# Altium project 200108 Discharge Module R0.PrjPcb
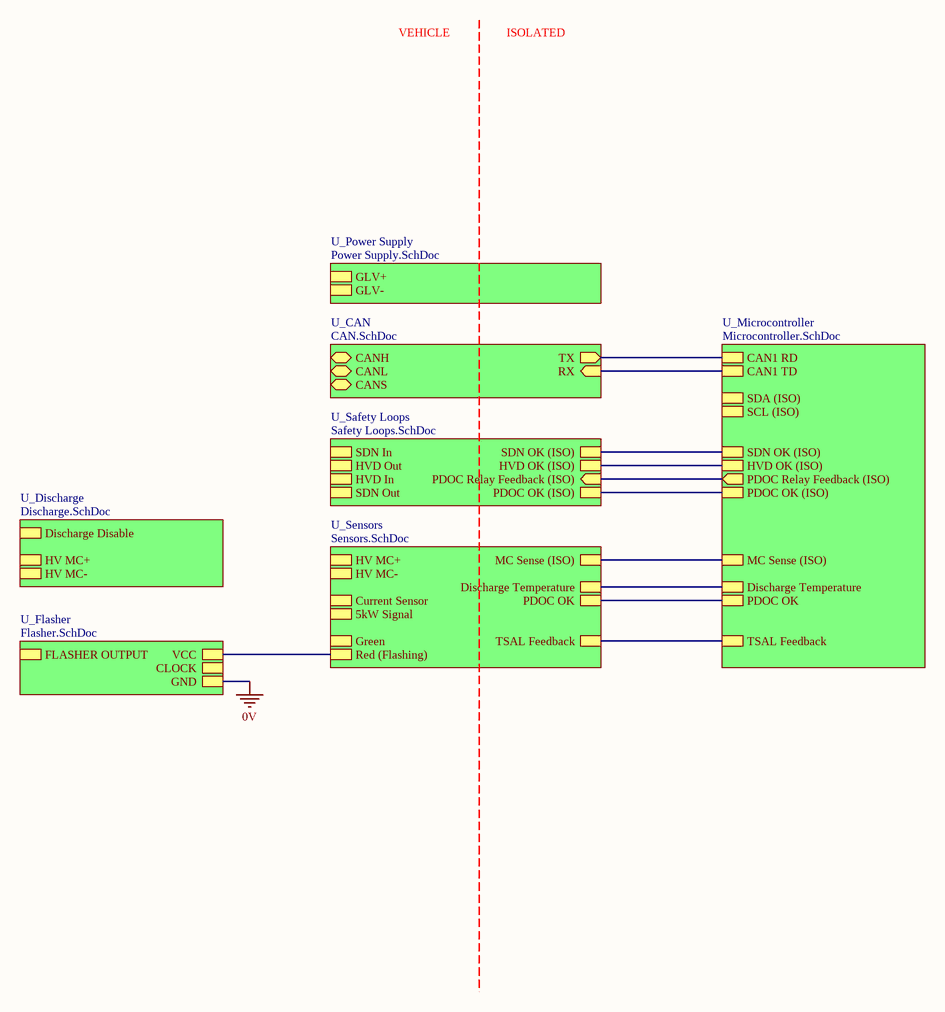
[diagram p0: Top Level.SchDoc]
7 sheets, 169 parts. Net scope: hierarchical (ports join the sheet entries above them; power ports are global).
Sheets:
  Top Level.SchDoc
    U_Power Supply = Power Supply.SchDoc
    U_Safety Loops = Safety Loops.SchDoc
    U_Sensors = Sensors.SchDoc
    U_Flasher = Flasher.SchDoc
    U_Microcontroller = Microcontroller.SchDoc
    U_Discharge = Discharge.SchDoc

## Sheet Top Level.SchDoc
size A4

### Sub-sheets
U_CAN = CAN.SchDoc (file not in this document): CANS (bidir), RX (in), CANL (bidir), CANH (bidir), TX (out)
U_Discharge = Discharge.SchDoc: HV MC+, HV MC-, Discharge Disable
U_Flasher = Flasher.SchDoc: VCC, GND, CLOCK, FLASHER OUTPUT
U_Microcontroller = Microcontroller.SchDoc: CAN1 RD, CAN1 TD, SDN OK (ISO), HVD OK (ISO), PDOC Relay Feedback (ISO) (out), PDOC OK (ISO), MC Sense (ISO), Discharge Temperature, PDOC OK, TSAL Feedback, SDA (ISO), SCL (ISO)
U_Power Supply = Power Supply.SchDoc: GLV+, GLV-
U_Safety Loops = Safety Loops.SchDoc: HVD Out, SDN In, SDN OK (ISO), SDN Out, HVD In, HVD OK (ISO), PDOC Relay Feedback (ISO) (in), PDOC OK (ISO)
U_Sensors = Sensors.SchDoc: HV MC+, HV MC-, MC Sense (ISO), TSAL Feedback, Current Sensor, 5kW Signal, Green, Red (Flashing), PDOC OK, Discharge Temperature

### Nets
VCC: sheet U_Sensors/Red (Flashing), sheet U_Flasher/VCC
PB8: sheet U_CAN/TX, sheet U_Microcontroller/CAN1 RD
PB9: sheet U_CAN/RX, sheet U_Microcontroller/CAN1 TD
NetC29#1_2: sheet U_Sensors/Discharge Temperature, sheet U_Microcontroller/Discharge Temperature
NetC38_2: sheet U_Sensors/MC Sense (ISO), sheet U_Microcontroller/MC Sense (ISO)
NetHVD_Bypass1_1: sheet U_Safety Loops/HVD Out, sheet U_Safety Loops/SDN In, sheet U_Safety Loops/HVD In
NetK1_4: sheet U_Safety Loops/PDOC Relay Feedback (ISO), sheet U_Microcontroller/PDOC Relay Feedback (ISO)
NetK2_13: sheet U_Sensors/TSAL Feedback, sheet U_Microcontroller/TSAL Feedback
NetQ2_G: sheet U_Safety Loops/PDOC OK (ISO), sheet U_Microcontroller/PDOC OK (ISO)
NetR15_2: sheet U_Safety Loops/SDN OK (ISO), sheet U_Microcontroller/SDN OK (ISO)
NetR18_2: sheet U_Safety Loops/HVD OK (ISO), sheet U_Microcontroller/HVD OK (ISO)
NetR46_1: sheet U_Sensors/PDOC OK, sheet U_Microcontroller/PDOC OK

### Notes on the sheet
- VEHICLE
- ISOLATED

## Sheet Power Supply.SchDoc
size A4
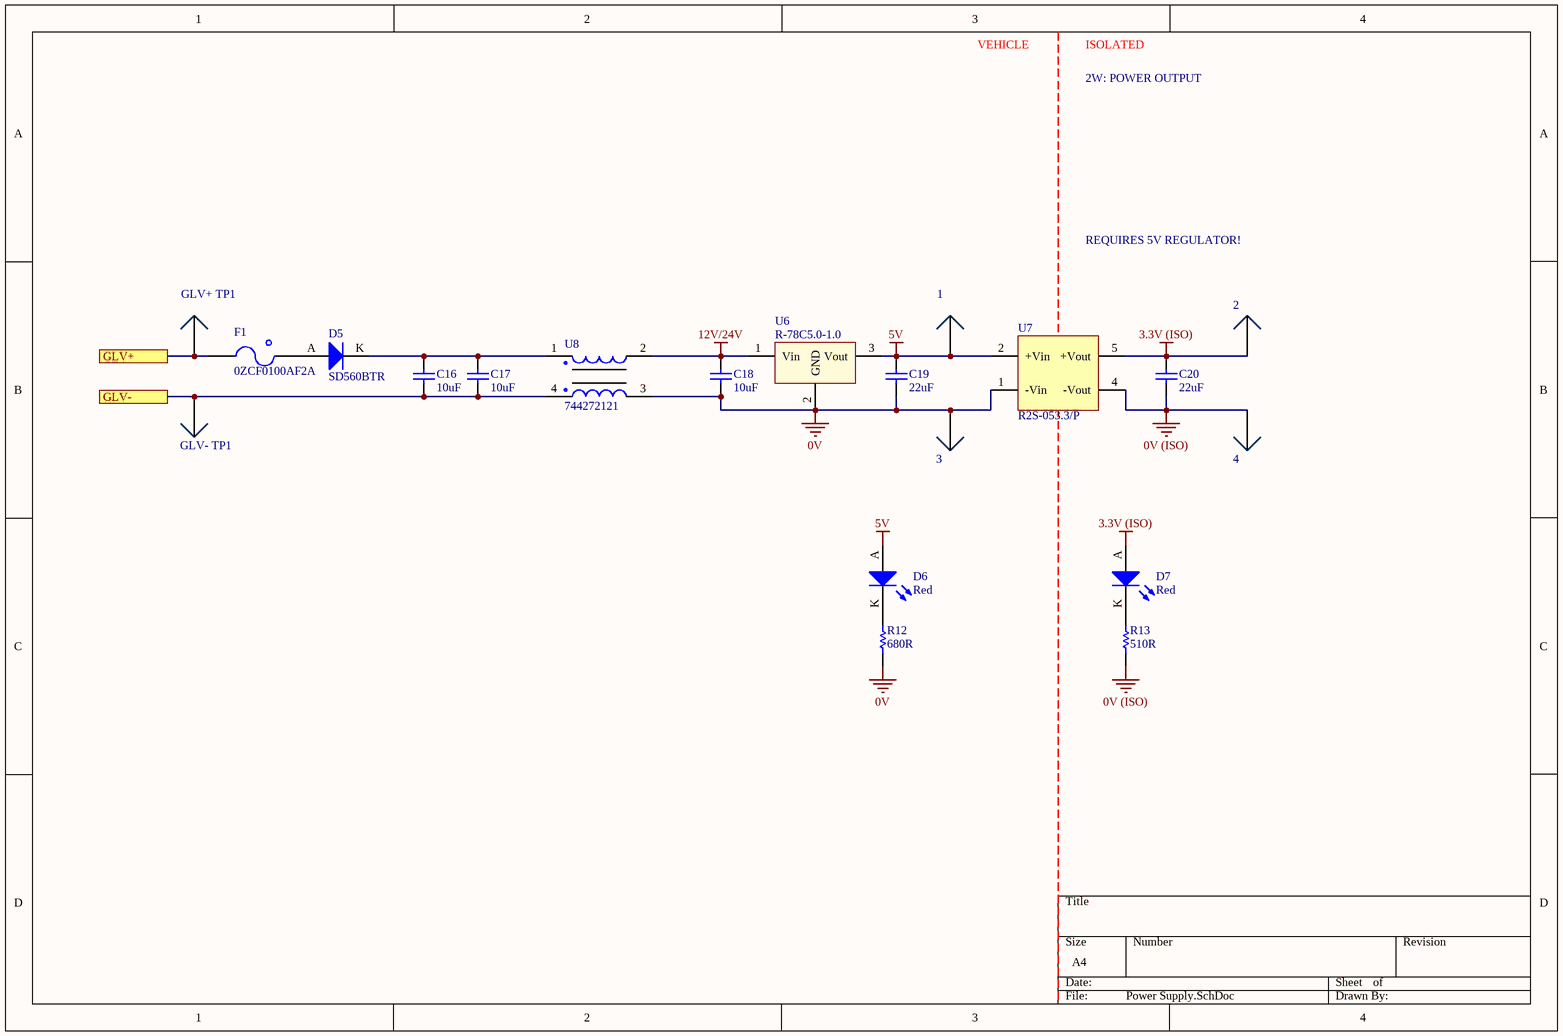
[diagram p1: Power Supply.SchDoc]

### Parts
1  0mm  [SMD Test Point]  (value not drawn)
2  0mm  [SMD Test Point]  (value not drawn)
3  0mm  [SMD Test Point]  (value not drawn)
4  0mm  [SMD Test Point]  (value not drawn)
C16  10uF  [0805]
C17  10uF  [0805]
C18  10uF  [0805]
C19  22uF  [1206]
C20  22uF  [1206]
D5  SD560BTR  [SMB Diode]
D6  Red  [0805 LED]
D7  Red  [0805 LED]
F1  0ZCF0100AF2A  [2920]
GLV+_TP1  0mm  [SMD Test Point]  (value not drawn)
GLV-_TP1  0mm  [SMD Test Point]  (value not drawn)
R12  680R  [0805]
R13  510R  [0805]
U6  R-78C5.0-1.0  [RECOM 3-SIP]
U7  R2S-053.3/P  [RECOM 8-SMD (5 Pin)]
U8  744272121  [Wurth 4-PC Pad]

### Ports
GLV+, GLV-

### Nets
0V: 3.1 C18.1 C19.1 R12.1 U6.2(GND) U7.1(-Vin) U8.3
0V (ISO): 4.1 C20.1 R13.1 U7.4(-Vout)
3.3V (ISO): 2.1 C20.2 D7.A U7.5(+Vout)
5V: 1.1 C19.2 D6.A U6.3(Vout) U7.2(+Vin)
12V/24V: C18.2 U6.1(Vin) U8.2
NetC16_1: C16.1 C17.1 GLV-_TP1.1 U8.4 ; port GLV-
NetC16_2: C16.2 C17.2 D5.K U8.1
NetD5_A: D5.A F1.2
NetD6_K: D6.K R12.2
NetD7_K: D7.K R13.2
NetF1_1: F1.1 GLV+_TP1.1 ; port GLV+

### Notes on the sheet
- VEHICLE
- ISOLATED
- 2W: POWER OUTPUT
- REQUIRES 5V REGULATOR!

### Library data of the parts
1-4 GLV+_TP1 GLV-_TP1 = SMD Test Point: Positions: 1; Row Spacing: 0; Flange: No; Contact: NA; Part Number: SMD Test Point; Pitch: 0mm; Angle: 0
C16-C18 = GRM21BR6YA106KE43L: Manufacturer: muRata; Tolerance: 10%; Material: X5R; Rated Voltage: 50V; Part Number: GRM21BR6YA106KE43L; Value: 10uF; Digikey Part Number: 490-10514-6-ND
C19 C20 = CC1206MKX5R7BB226: Manufacturer: YAGEO; Tolerance: 20%; Material: Ceramic; Rated Voltage: 16V; Part Number: CC1206MKX5R7BB226; Value: 22uF; Digikey Part Number: 311-1997-2-ND
D5 = SD560BTR: 1.2V_F 600V 5A SMB; Manufacturer: SMC Diode Solutions; Part Number: SD560BTR; Digikey Part Number: 1655-1530-2-ND; Digikey Link: https://www.digikey.com/product-detail/en/smc-diode-solutions/SD560BTR/1655-1530-2-ND/6022620
D6 D7 = SML-210LTT86: Red LED Indication - Discrete 1.75V 0805 (2012 Metric); Manufacturer: ROHM Semiconductor; Part Number: SML-210LTT86; Colour: Red; Digikey Part Number: 511-1286-1-ND; Digikey Link: https://www.digikey.com/product-detail/en/rohm-semiconductor/SML-210LTT86/511-1286-1-ND/637099
F1 = 0ZCF0100AF2A: PTC RESET FUSE 60V 1A 292; Manufacturer: Littelfuse Inc.; Part Number: 0ZCF0100AF2A; Digikey Part Number: 507-2070-1-ND; Digikey Link: https://www.digikey.com/product-detail/en/bel-fuse-inc/0ZCF0100AF2A/507-2070-1-ND/6210547
R12 = RC0805FR07680RL: Manufacturer: YAGEO; Tolerance: 0.01; Rated Voltage: 0.125W; Part Number: RC0805FR07680RL; Value: 680R; Material: FR-07
R13 = RC0805FR07510RL: Manufacturer: YAGEO; Tolerance: 0.01; Rated Voltage: 0.125W; Part Number: RC0805FR07510RL; Value: 510R; Material: FR-07
U6 = R-78C5.0-1.0: CONV DC/DC 1A 5V OUT SIP VERT; Manufacturer: Recom; Isolation: Non-Isolated; Part Number: R-78C5.0-1.0; Digikey Part Number: 945-1395-5-ND; Digikey Link: https://www.digikey.com.au/product-detail/en/recom-power/R-78C5.0-1.0/945-1395-5-ND/2652148
U7 = R2S-053.3/P: Isolated Module DC DC Converter 1 Output 3.3V 606mA 4.5V - 5.5V Input; Manufacturer: Recom; Output Power: 2W; Efficiency: 0.75; Part Number: R2S-053.3/P; Input Voltage: 4.5V-5.5V; Output Voltage: 3.3V; Isolation: Isolated; Digikey Part Number: 945-2677-5-ND; Digikey Link: https://www.digikey.com/product-detail/en/recom-power/R2S-053.3-P/945-2677-5-ND/2302804
U8 = 744272121: 120µH @ 100kHz 2 Line Common Mode Choke Surface Mount 460 Ohms @ 30MHz 2.5A DCR 25mOhm; Manufacturer: Wurth Electronics Inc; Inductance: 120uH @ 100kHz; Part Number: 744272121; Impedence: 460 Ohms @ 30MHz; Material: Wirewound; Rated Current: 2.5A; Digikey Part Number: 732-1489-1-ND; Digikey Link: https://www.digikey.com/product-detail/en/w-rth-elektronik/744272121/732-1489-1-ND/1639501

## Sheet Safety Loops.SchDoc
size A4
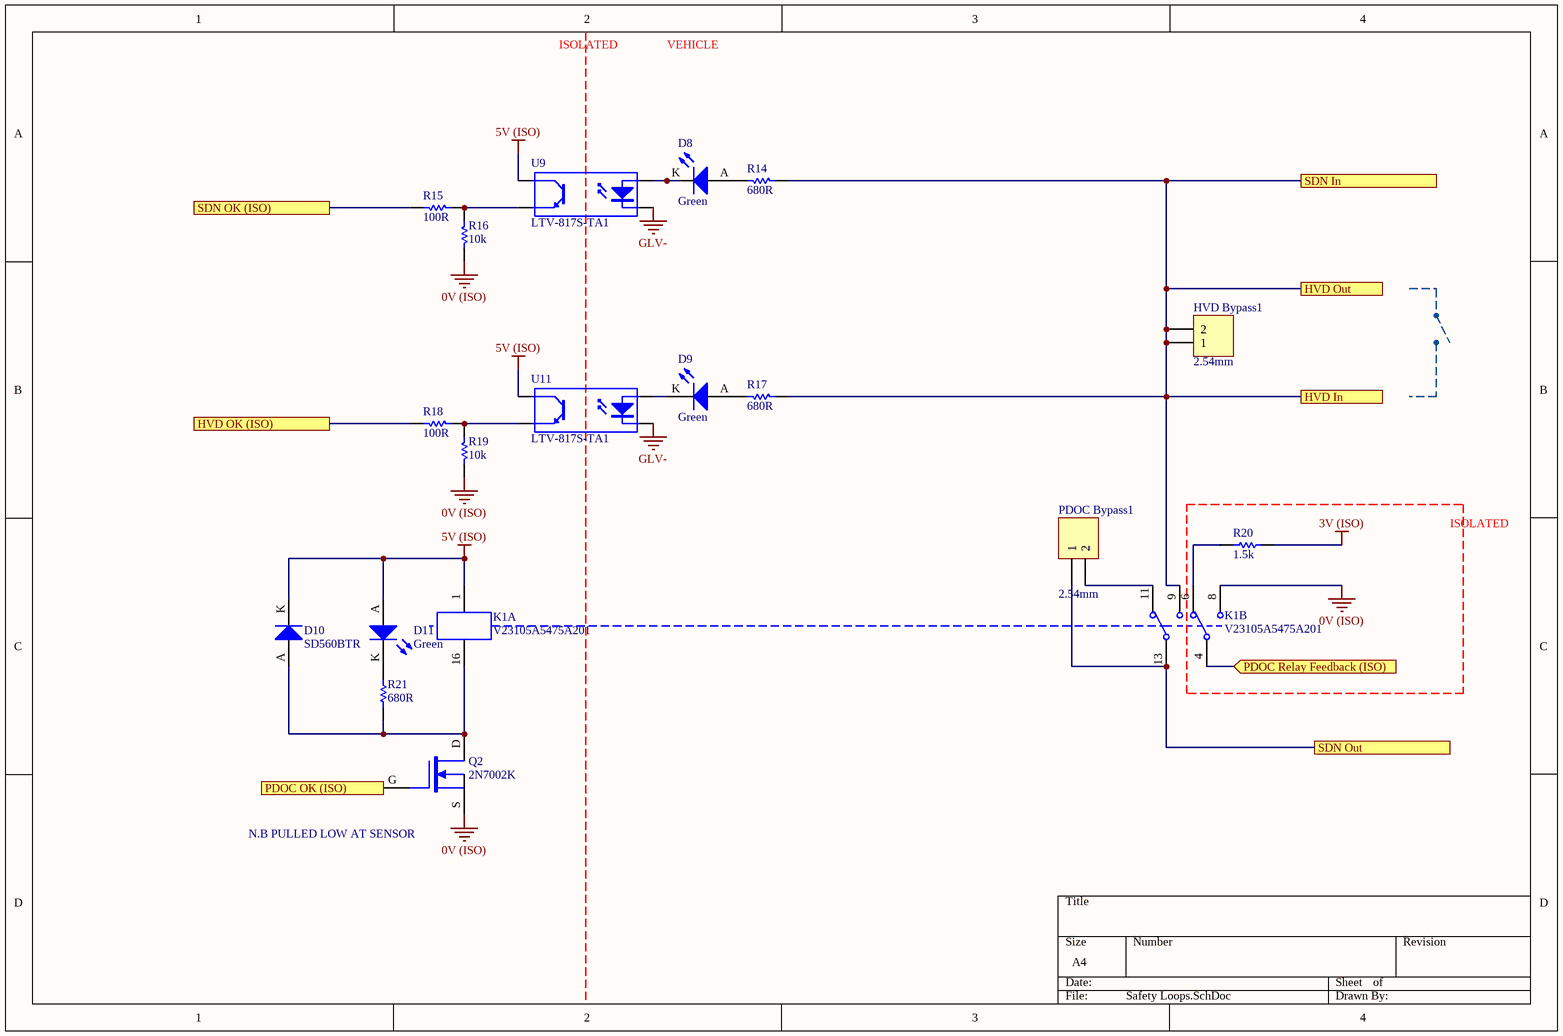
[diagram p2: Safety Loops.SchDoc]

### Parts
D8  Green  [0805 LED]
D9  Green  [0805 LED]
D10  SD560BTR  [SMB Diode]
D11  Green  [0805 LED]
HVD_Bypass1  2.54mm  [TH 2.54mm Header 1x2]
K1  V23105A5475A201  [TI 2-DIL]  (parts A,B of 2)
PDOC_Bypass1  2.54mm  [TH 2.54mm Header 1x2]
Q2  2N7002K  [SOT-343_N]
R14  680R  [0805]
R15  100R  [0805]
R16  10k  [0805]
R17  680R  [0805]
R18  100R  [0805]
R19  10k  [0805]
R20  1.5k  [0805]
R21  680R  [0805]
U9  LTV-817S-TA1  [ON 4-SMD]
U11  LTV-817S-TA1  [ON 4-SMD]

### Blocks framed on the sheet
ISOLATED: K1 R20

### Ports
HVD In, HVD OK (ISO), HVD Out, PDOC OK (ISO), PDOC Relay Feedback (ISO) (in), SDN In, SDN OK (ISO), SDN Out

### Nets
0V (ISO): K1.8 Q2.S R16.1 R19.1
3V (ISO): R20.2
5V (ISO): D10.K D11.A K1.1 U9.4(C) U11.4(C)
GLV-: U9.2(K) U11.2(K)
NetD8_A: D8.A R14.1
NetD8_K: D8.K U9.1(A)
NetD9_A: D9.A R17.1
NetD9_K: D9.K U11.1(A)
NetD10_A: D10.A K1.16 Q2.D R21.1
NetD11_K: D11.K R21.2
NetHVD_Bypass1_1: HVD_Bypass1.1 HVD_Bypass1.2 K1.9 R14.2 R17.2 ; port HVD Out, port HVD In, port SDN In
NetK1_4: K1.4 ; port PDOC Relay Feedback (ISO)
NetK1_6: K1.6 R20.1
NetK1_11: K1.11 PDOC_Bypass1.2
NetK1_13: K1.13 PDOC_Bypass1.1 ; port SDN Out
NetQ2_G: Q2.G ; port PDOC OK (ISO)
NetR15_1: R15.1 R16.2 U9.3(E)
NetR15_2: R15.2 ; port SDN OK (ISO)
NetR18_1: R18.1 R19.2 U11.3(E)
NetR18_2: R18.2 ; port HVD OK (ISO)

### Notes on the sheet
- ISOLATED
- VEHICLE
- (near Q2) N.B PULLED LOW AT SENSOR

### Library data of the parts
D8 D9 D11 = SML-210FTT86: Green LED Indication - Discrete 1.75V 0805 (2012 Metric); Manufacturer: ROHM Semiconductor; Part Number: SML-210FTT86; Colour: Green; Digikey Part Number: 511-1285-1-ND; Digikey Link: https://www.digikey.com/product-detail/en/rohm-semiconductor/SML-210FTT86/511-1285-1-ND/637098
D10 = SD560BTR: as D5 on sheet Power Supply; Part Number: SD560BTR; Digikey Part Number: 1655-1530-2-ND; Digikey Link: https://www.digikey.com/product-detail/en/smc-diode-solutions/SD560BTR/1655-1530-2-ND/6022620
HVD_Bypass1 PDOC_Bypass1 = TH 2.54mm Header 1x2: Positions: 2; Angle: 0; Flange: No; Contact: NA; Part Number: TH 2.54mm Header 1x2; Pitch: 2.54mm; Row Spacing: 2.54mm
K1 = V23105A5475A201: 5V DPDT Relay 3A 220VDC; Manufacturer: Axicom; Part Number: V23105A5475A201; Digikey Part Number: PB383-ND; Digikey Link: https://www.digikey.com/products/en?mpart=V23105A5001A201&v=41
Q2 = 2N7002K: 60V 380mA, NFET MOSTFET (Small Signal); Manufacturer: ON Semiconductor; Published: 24-Mar-1999; LatestRevisionDate: 29-May-2009; LatestRevisionNote: IPC-7351 Footprint Added.; PackageVersion: Sep-2000; PackageReference: SOT-343; Publisher: Altium Limited; PackageDescription: 4-Pin SOT-343 Package 1.3 mm Pitch, 2.1 mm Lead Span; Part Number: 2N7002K; Digikey Part Number: 2N7002KCT-ND; Digikey Link: https://www.digikey.com/product-detail/en/on-semiconductor/2N7002K/2N7002KCT-ND/2060375; Qty: 30
R14 R17 R21 = RC0805FR07680RL: as R12 on sheet Power Supply; Part Number: RC0805FR07680RL; Value: 680R; Material: FR-07
R15 R18 = RC0805FR07100RL: Manufacturer: YAGEO; Tolerance: 0.01; Rated Voltage: 0.125W; Part Number: RC0805FR07100RL; Value: 100R; Material: FR-07
R16 R19 = RC0805FR0710KL: Manufacturer: YAGEO; Tolerance: 0.01; Rated Voltage: 0.125W; Part Number: RC0805FR0710KL; Value: 10k; Material: FR-07
R20 = RC0805FR071K5L: Manufacturer: YAGEO; Tolerance: 0.01; Rated Voltage: 0.125W; Part Number: RC0805FR071K5L; Value: 1.5k; Material: FR-07
U9 U11 = LTV-817S-TA1: 35V 50ma Optocoupler (VF=1.2V); Manufacturer: Lite-On Inc; Part Number: LTV-817S-TA1; Digikey Part Number: 160-1893-2-ND; Digikey Link: https://www.digikey.com/product-detail/en/lite-on-inc/LTV-817S-TA1/160-1893-2-ND/388451

## Sheet Sensors.SchDoc
size A3
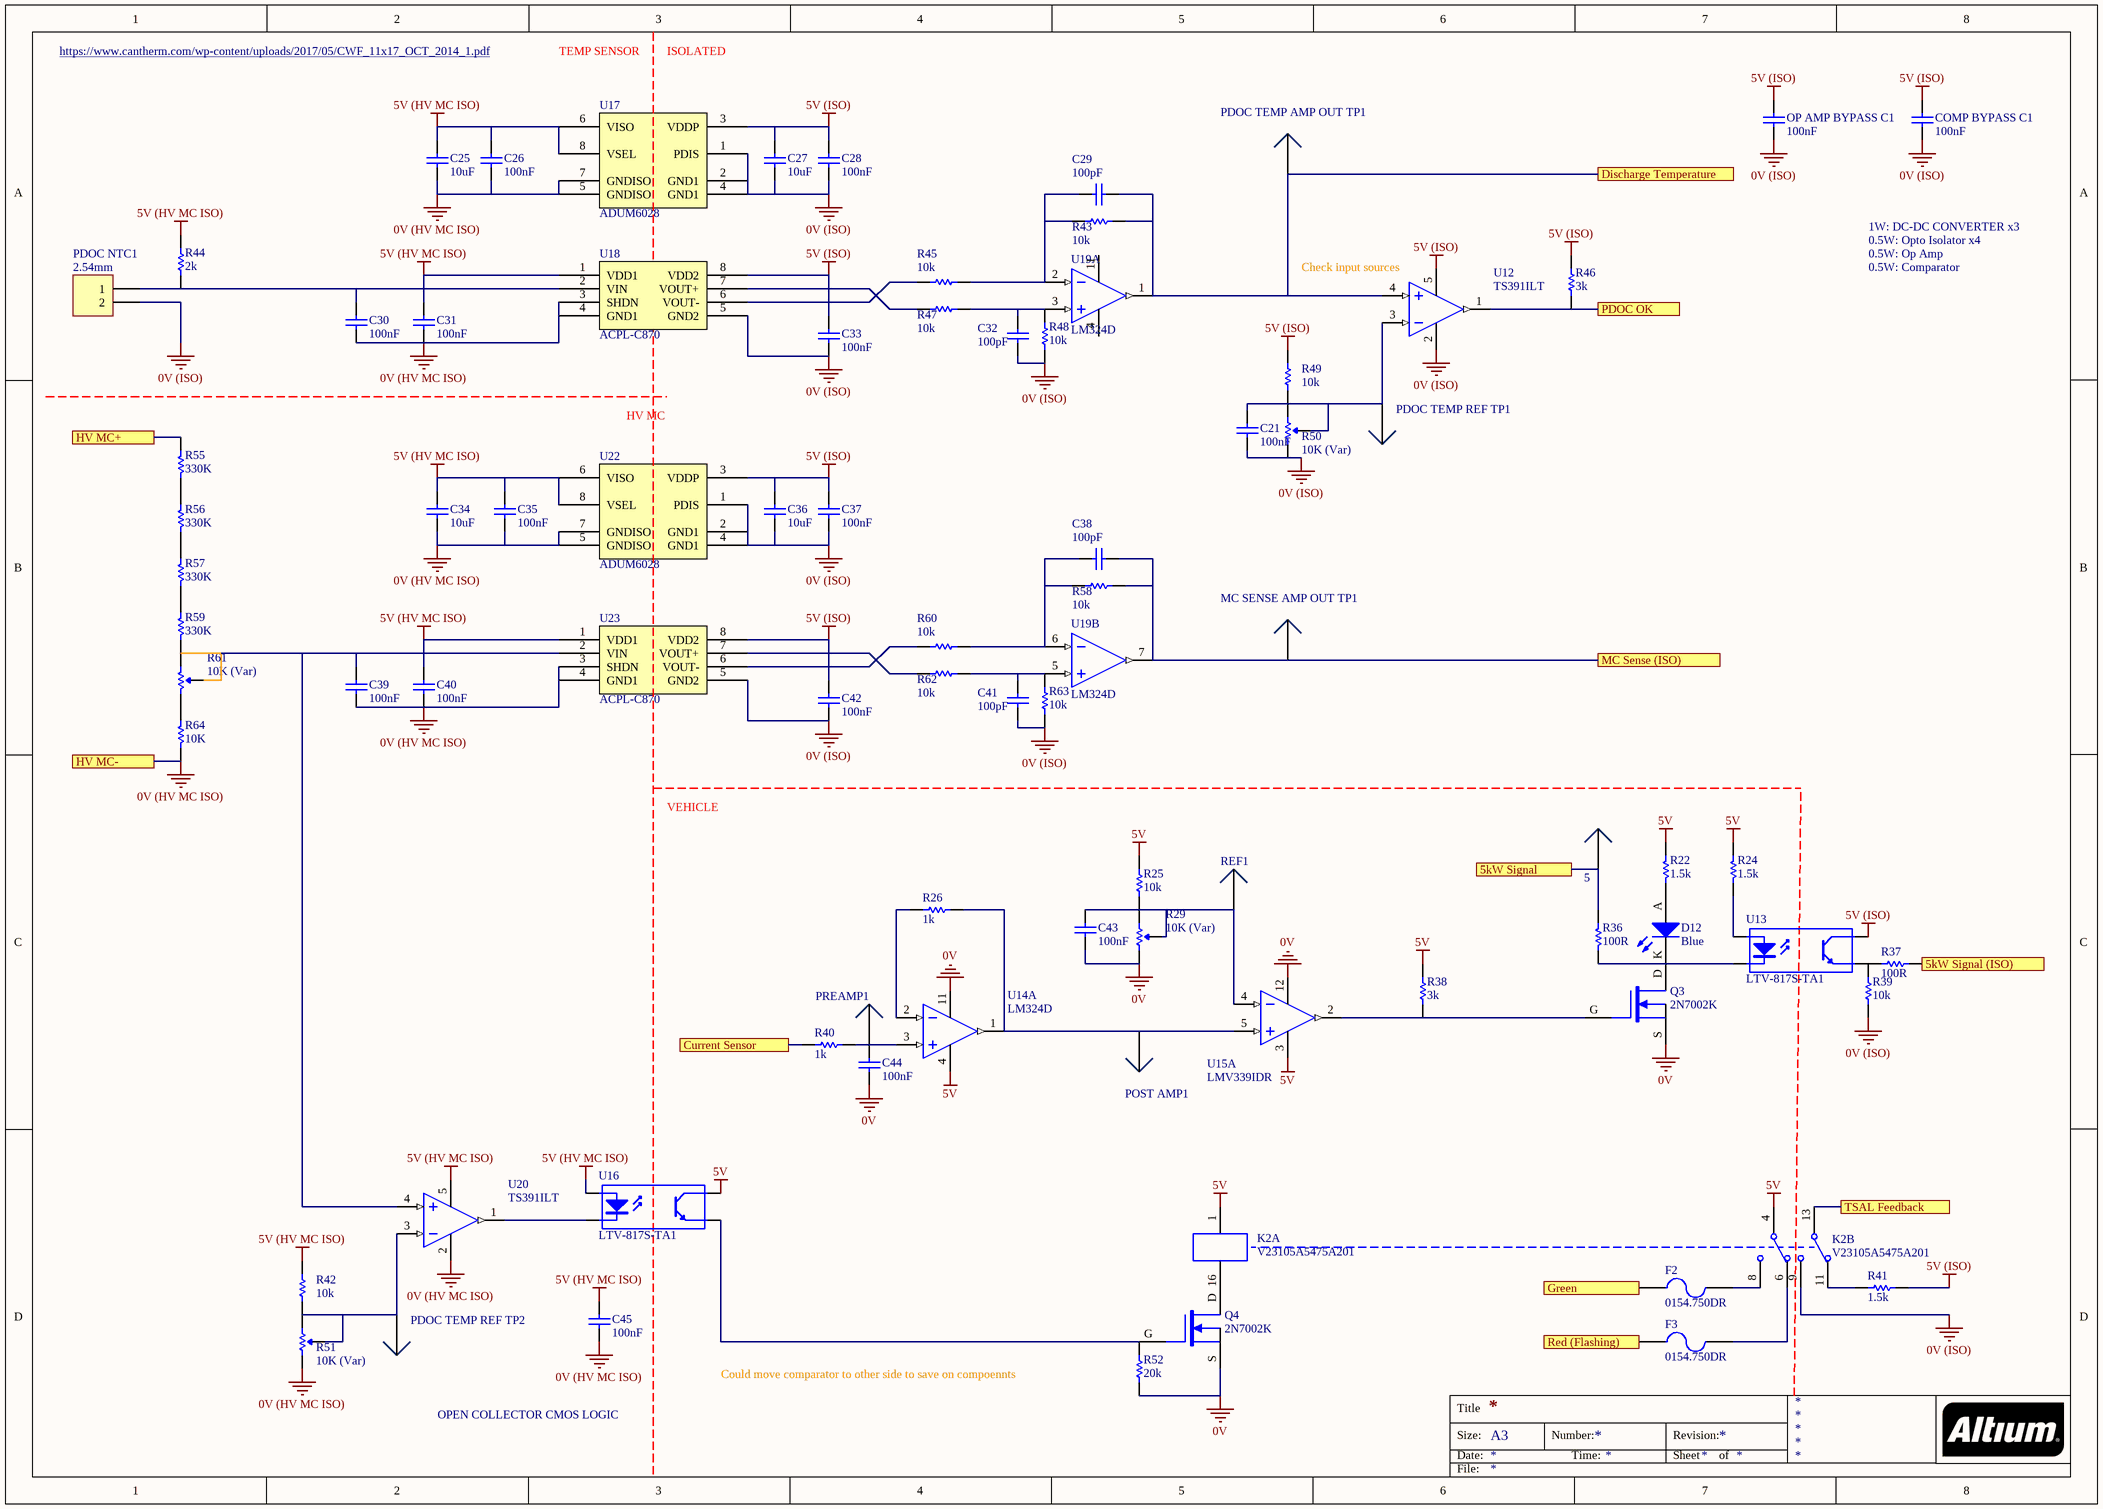
[diagram p3: Sensors.SchDoc]

### Parts
(Parts that share a designator on the sheet are numbered #1, #2 ... from top to bottom, then left to right.)
5  0mm  [TH Test Point]  (value not drawn)
C21  100nF  [0805]
C25#1  10uF  [0805]
C26#1  100nF  [0805]
C27#1  10uF  [0805]
C28#1  100nF  [0805]
C29#1  100pF  [0805]
C30#1  100nF  [0805]
C31  100nF  [0805]
C32  100pF  [0805]
C33  100nF  [0805]
C34  10uF  [0805]
C35  100nF  [0805]
C36  10uF  [0805]
C37  100nF  [0805]
C38  100pF  [0805]
C39  100nF  [0805]
C40  100nF  [0805]
C41  100pF  [0805]
C42  100nF  [0805]
C43  100nF  [0805]
C44  100nF  [0805]
C45  100nF  [0805]
COMP_BYPASS_C1  100nF  [0805]
D12  Blue  [0805 LED]
F2  0154.750DR  [Omni BLOK 0154]
F3  0154.750DR  [Omni BLOK 0154]
K2  V23105A5475A201  [TI 2-DIL]  (parts A,B of 2)
MC_SENSE_AMP_OUT_TP1  0mm  [SMD Test Point]  (value not drawn)
OP_AMP_BYPASS_C1  100nF  [0805]
PDOC_NTC1  2.54mm  [TH 2.54mm Header 1x2]
PDOC_TEMP_AMP_OUT_TP1  0mm  [SMD Test Point]  (value not drawn)
PDOC_TEMP_REF_TP1  0mm  [SMD Test Point]  (value not drawn)
PDOC_TEMP_REF_TP2  0mm  [SMD Test Point]  (value not drawn)
POST_AMP1  0mm  [TH Test Point]  (value not drawn)
PREAMP1  0mm  [TH Test Point]  (value not drawn)
Q3  2N7002K  [ON SOT-23 MOSFET]
Q4  2N7002K  [ON SOT-23 MOSFET]
R22  1.5k  [0805]
R24  1.5k  [0805]
R25  10k  [0805]
R26  1k  [0805]
R29  10K (Var)  [B 3296]
R36  100R  [0805]
R37  100R  [0805]
R38  3k  [0805]
R39  10k  [0805]
R40  1k  [0805]
R41  1.5k  [0805]
R42  10k  [0805]
R43  10k  [0805]
R44  2k  [0805]
R45  10k  [0805]
R46  3k  [0805]
R47  10k  [0805]
R48  10k  [0805]
R49  10k  [0805]
R50  10K (Var)  [B 3296]
R51  10K (Var)  [B 3296]
R52  20k  [0805]
R55  330K  [VB 0207]
R56  330K  [VB 0207]
R57  330K  [VB 0207]
R58  10k  [0805]
R59  330K  [VB 0207]
R60  10k  [0805]
R61  10K (Var)  [B 3296]
R62  10k  [0805]
R63  10k  [0805]
R64  10K  [VB 0207]
REF1  0mm  [TH Test Point]  (value not drawn)
U12  TS391ILT  [ON SOT-23-5]
U13  LTV-817S-TA1  [ON 4-SMD]
U14  LM324D  [TI 14-SOIC]  (part A of 4)
U15  LMV339IDR  [TI 14-SOIC]  (part A of 4)
U16  LTV-817S-TA1  [ON 4-SMD]
U17  ADUM6028  [AD 8-SOIC-W]
U18  ACPL-C870  [BROAD 8-SOIC]
U19  LM324D  [TI 14-SOIC]  (parts A,B of 4)
U20  TS391ILT  [ON SOT-23-5]
U22  ADUM6028  [AD 8-SOIC-W]
U23  ACPL-C870  [BROAD 8-SOIC]

### Ports
5kW Signal, 5kW Signal (ISO), Current Sensor, Discharge Temperature, Green, HV MC+, HV MC-, MC Sense (ISO), PDOC OK, Red (Flashing), TSAL Feedback

### Nets
0V: C43.1 C44.1 Q3.S Q4.S R29.3(CW) R52.1 U14.11(GND) U15.12(V-)
0V (HV MC ISO): C25#1.1 C26#1.1 C30#1.1 C31.1 C34.1 C35.1 C39.1 C40.1 C45.1 R51.3(CW) R64.1 U17.5(GNDISO) U17.7(GNDISO) U18.3(SHDN) U18.4(GND1) U20.2(VCC-) U22.5(GNDISO) U22.7(GNDISO) U23.3(SHDN) U23.4(GND1) ; port HV MC-
0V (ISO): C21.1 C27#1.1 C28#1.1 C32.1 C33.1 C36.1 C37.1 C41.1 C42.1 COMP_BYPASS_C1.1 K2.9 OP_AMP_BYPASS_C1.1 PDOC_NTC1.2 R39.1 R48.1 R50.3(CW) R63.1 U12.2(VCC-) U17.1(PDIS) U17.2(GND1) U17.4(GND1) U18.5(GND2) U22.1(PDIS) U22.2(GND1) U22.4(GND1) U23.5(GND2)
5V: K2.1 K2.4 R22.2 R24.2 R25.2 R38.2 U14.4(VCC) U15.3(V+) U16.4(C)
5V (HV MC ISO): C25#1.2 C26#1.2 C31.2 C34.2 C35.2 C40.2 C45.2 R42.2 R44.2 U16.1(A) U17.6(VISO) U17.8(VSEL) U18.1(VDD1) U20.5(VCC+) U22.6(VISO) U22.8(VSEL) U23.1(VDD1)
5V (ISO): C27#1.2 C28#1.2 C33.2 C36.2 C37.2 C42.2 COMP_BYPASS_C1.2 OP_AMP_BYPASS_C1.2 R41.2 R46.2 R49.2 U12.5(VCC+) U13.4(C) U17.3(VDDP) U18.8(VDD2) U22.3(VDDP) U23.8(VDD2)
VCC: F3.1 ; port Red (Flashing)
Net5_1: 5.1 R36.2 ; port 5kW Signal
NetC21_2: C21.2 PDOC_TEMP_REF_TP1.1 R49.1 R50.1(CCW) R50.2(Wiper) U12.3(IN-)
NetC29#1_1: C29#1.1 R43.1 R45.2 U19.2(1IN+)
NetC29#1_2: C29#1.2 PDOC_TEMP_AMP_OUT_TP1.1 R43.2 U12.4(IIN+) U19.1(1OUT) ; port Discharge Temperature
NetC30#1_2: C30#1.2 PDOC_NTC1.1 R44.1 U18.2(VIN)
NetC32_2: C32.2 R47.2 R48.2 U19.3(1IN+)
NetC38_1: C38.1 R58.1 R60.2 U19.6(2IN-)
NetC38_2: C38.2 MC_SENSE_AMP_OUT_TP1.1 R58.2 U19.7(2OUT) ; port MC Sense (ISO)
NetC39_2: C39.2 R59.1 R61.2(Wiper) R61.3(CW) U20.4(IIN+) U23.2(VIN)
NetC41_2: C41.2 R62.2 R63.2 U19.5(2IN+)
NetC43_2: C43.2 R25.1 R29.1(CCW) R29.2(Wiper) REF1.1 U15.4(IN_A-)
NetC44_2: C44.2 PREAMP1.1 R40.2 U14.3(1IN+)
NetD12_A: D12.A R22.1
NetD12_K: D12.K Q3.D R36.1 U13.2(K)
NetF2_1: F2.1 ; port Green
NetF2_2: F2.2 K2.8
NetF3_2: F3.2 K2.6
NetK2_11: K2.11 R41.1
NetK2_13: K2.13 ; port TSAL Feedback
NetK2_16: K2.16 Q4.D
NetPDOC_TEMP_REF_TP2_1: PDOC_TEMP_REF_TP2.1 R42.1 R51.1(CCW) R51.2(Wiper) U20.3(IN-)
NetPOST_AMP1_1: POST_AMP1.1 R26.2 U14.1(1OUT) U15.5(IN_A+)
NetQ3_G: Q3.G R38.1 U15.2(OUT_A)
NetQ4_G: Q4.G R52.2 U16.3(E)
NetR24_1: R24.1 U13.1(A)
NetR26_1: R26.1 U14.2(1IN+)
NetR37_1: R37.1 R39.2 U13.3(E)
NetR37_2: R37.2 ; port 5kW Signal (ISO)
NetR40_1: R40.1 ; port Current Sensor
NetR45_1: R45.1 U18.6(VOUT-)
NetR46_1: R46.1 U12.1(OUT) ; port PDOC OK
NetR47_1: R47.1 U18.7(VOUT+)
NetR55_1: R55.1 R56.2
NetR55_2: R55.2 ; port HV MC+
NetR56_1: R56.1 R57.2
NetR57_1: R57.1 R59.2
NetR60_1: R60.1 U23.6(VOUT-)
NetR61_1: R61.1(CCW) R64.2
NetR62_1: R62.1 U23.7(VOUT+)
NetU16_2: U16.2(K) U20.1(OUT)

Not connected (* = marked no-connect by the designer): U19 4(VCC) 11(GND)

### Notes on the sheet
- https://www.cantherm.com/wp-content/uploads/2017/05/CWF_11x17_OCT_2014_1.pdf
- TEMP SENSOR
- ISOLATED
- 1W: DC-DC CONVERTER x3
- 0.5W: Opto Isolator x4
- (near U12) Check input sources
- 0.5W: Op Amp
- 0.5W: Comparator
- HV MC
- VEHICLE
- Could move comparator to other side to save on compoennts
- OPEN COLLECTOR CMOS LOGIC
- Title
- Size:
- Date:
- A3
- Number:
- Time:
- Revision:
- Sheet
- of
- File:

### Library data of the parts
5 POST_AMP1 PREAMP1 REF1 = TH Test Point: Positions: 1; Angle: 0; Flange: No; Contact: NA; Part Number: TH Test Point; Pitch: 0mm; Row Spacing: 0mm
C21 C26#1 C28#1 C30#1 C31 C33 C35 C37 C39 C40 C42-C45 = GCM21BR71E104KA37L: Manufacturer: muRata; Tolerance: 10%; Material: X7R; Rated Voltage: 25V; Part Number: GCM21BR71E104KA37L; Value: 100nF
C25#1 C27#1 C34 C36 = GRM21BR6YA106KE43L: as C16 on sheet Power Supply; Part Number: GRM21BR6YA106KE43L; Value: 10uF; Digikey Part Number: 490-10514-6-ND
C29#1 C32 C38 C41 = GCM21B5C1H101JA37L: Manufacturer: muRata; Tolerance: 5%; Material: C0G; Rated Voltage: 50V; Part Number: GCM21B5C1H101JA37L; Value: 100pF
COMP_BYPASS_C1 OP_AMP_BYPASS_C1 = GCM21BR71E104KA37L: Manufacturer: muRata; Tolerance: 10%; Rated Voltage: 25V; Part Number: GCM21BR71E104KA37L; Value: 100nF; Material: X7R
D12 = SML-MN2BCTT86C: LED BLUE CLEAR 2012 SMD; Manufacturer: ROHM Semiconductor; Part Number: SML-MN2BCTT86C; Colour: Blue; Digikey Part Number: 846-1207-1-ND; Digikey Link: https://www.digikey.com/product-detail/en/rohm-semiconductor/SMLMN2BCTT86C/846-1207-1-ND/6057239
F2 F3 = 0154.750DR: FUSE BOARD MNT 750MA 125VAC/VDC; Manufacturer: LittelFuse Inc; Part Number: 0154.750DR; Digikey Part Number: F1221CT-ND; Digikey Link: https://www.digikey.com/product-detail/en/littelfuse-inc/0154.750DR/F1221CT-ND/183370
K2 = V23105A5475A201: as K1 on sheet Safety Loops; Part Number: V23105A5475A201; Digikey Part Number: PB383-ND; Digikey Link: https://www.digikey.com/products/en?mpart=V23105A5001A201&v=41
MC_SENSE_AMP_OUT_TP1 PDOC_TEMP_AMP_OUT_TP1 PDOC_TEMP_REF_TP1 PDOC_TEMP_REF_TP2 = SMD Test Point: as 1 on sheet Power Supply; Part Number: SMD Test Point; Pitch: 0mm; Angle: 0
PDOC_NTC1 = TH 2.54mm Header 1x2: as HVD_Bypass1 on sheet Safety Loops; Part Number: TH 2.54mm Header 1x2; Pitch: 2.54mm; Row Spacing: 2.54mm
Q3 Q4 = 2N7002K: as Q2 on sheet Safety Loops; Published: 24-Mar-1999; LatestRevisionDate: 29-May-2009; LatestRevisionNote: IPC-7351 Footprint Added.; PackageVersion: Sep-2000; PackageReference: SOT-343; Publisher: Altium Limited; PackageDescription: 4-Pin SOT-343 Package 1.3 mm Pitch, 2.1 mm Lead Span; Part Number: 2N7002K; Digikey Part Number: 2N7002KCT-ND; Digikey Link: https://www.digikey.com/product-detail/en/on-semiconductor/2N7002K/2N7002KCT-ND/2060375; Qty: 30
R22 R24 R41 = RC0805FR071K5L: as R20 on sheet Safety Loops; Part Number: RC0805FR071K5L; Value: 1.5k; Material: FR-07
R25 R39 R42 R43 R45 R47-R49 R58 R60 R62 R63 = RC0805FR0710KL: as R16 on sheet Safety Loops; Part Number: RC0805FR0710KL; Value: 10k; Material: FR-07
R26 R40 = RC0805FR071KL: Manufacturer: YAGEO; Tolerance: 0.01; Rated Voltage: 0.125W; Part Number: RC0805FR071KL; Value: 1k; Material: FR-07
R29 R50 R51 R61 = 3296W-1-103LF: Manufacturer: Bournes Inc; Tolerance: 0.1; Rated Voltage: 0.5W; Part Number: 3296W-1-103LF; Value: 10K (Var); Digikey Part Number: 3296W-103LF-ND
R36 R37 = RC0805FR07100RL: as R15 on sheet Safety Loops; Part Number: RC0805FR07100RL; Value: 100R; Material: FR-07
R38 R46 = RC0805FR073KL: Manufacturer: YAGEO; Tolerance: 0.01; Rated Voltage: 0.125W; Part Number: RC0805FR073KL; Value: 3k; Material: FR-07
R44 = RC0805FR072KL: Manufacturer: YAGEO; Tolerance: 0.01; Rated Voltage: 0.125W; Part Number: RC0805FR072KL; Value: 2k; Material: FR-07
R52 = RC0805FR0720KL: Manufacturer: YAGEO; Tolerance: 0.01; Rated Voltage: 0.125W; Part Number: RC0805FR0720KL; Value: 20k; Material: FR-07
R55-R57 R59 = MMB02070C3303FB200: Manufacturer: Vishay Beyschlag; Tolerance: 0.01; Rated Voltage: 1W; Part Number: MMB02070C3303FB200; Value: 330K; Digikey Part Number: MMB-330KBCT-ND
R64 = MMB02070C1002FB200: Manufacturer: Vishay Beyschlag; Tolerance: 0.01; Rated Voltage: 1W; Part Number: MMB02070C1002FB200; Value: 10K; Digikey Part Number: MMB-10KBCT-ND
U12 U20 = TS391ILT: IC COMP LO PWR SGL V SOT 23-5L; Manufacturer: STMicroelectronics; Part Number: TS391ILT; Digikey Part Number: 497-2275-2-ND; Digikey Link: https://www.digikey.com/product-detail/en/stmicroelectronics/TS391ILT/497-2275-2-ND/599407
U13 U16 = LTV-817S-TA1: as U9 on sheet Safety Loops; Part Number: LTV-817S-TA1; Digikey Part Number: 160-1893-2-ND; Digikey Link: https://www.digikey.com/product-detail/en/lite-on-inc/LTV-817S-TA1/160-1893-2-ND/388451
U14 U19 = LM324D: IC OPAMP GP 4 CIRCUIT 14SOIC; Manufacturer: Texas Instruments; Part Number: LM324D; Digikey Part Number: 296-1390-5-ND; Digikey Link: https://www.digikey.com/product-detail/en/texas-instruments/LM324D/296-1390-5-ND/277039
U15 = LMV339IDR: Comparator General Purpose Open Collector 14-SOIC; Manufacturer: Texas Instruments; Part Number: LMV339IDR; Digikey Part Number: 296-6611-2-ND; Digikey Link: https://www.digikey.com/product-detail/en/texas-instruments/LMV339MTX-NOPB/296-35446-1-ND/3739150
U17 U22 = ADUM6028: Isolated Module DC DC Converter 1 Output 3.3V, 5V 60mA 4.5V - 5.5V Input; Manufacturer: Analog Devices; Output Voltage: 5V, 3.3V; Output Power: 2W; Efficiency: 0.33; Part Number: ADUM6028; Input Voltage: 4.5V-5.5V; Isolation: Isolated; Digikey Part Number: ADUM6028-5BRIZ-ND; Digikey Link: https://www.digikey.com/product-detail/en/analog-devices-inc/ADUM6028-5BRIZ/ADUM6028-5BRIZ-ND/9485494
U18 U23 = ACPL-C870: Isolation Amplifier 1 Circuit Differential 8-SO; Manufacturer: Broadcom Limited; Part Number: ACPL-C870; Digikey Part Number: 516-2578-5-ND; Digikey Link: https://www.digikey.com/product-detail/en/broadcom-limited/ACPL-C870-000E/516-2578-5-ND/3523705

## Sheet Flasher.SchDoc
size A4
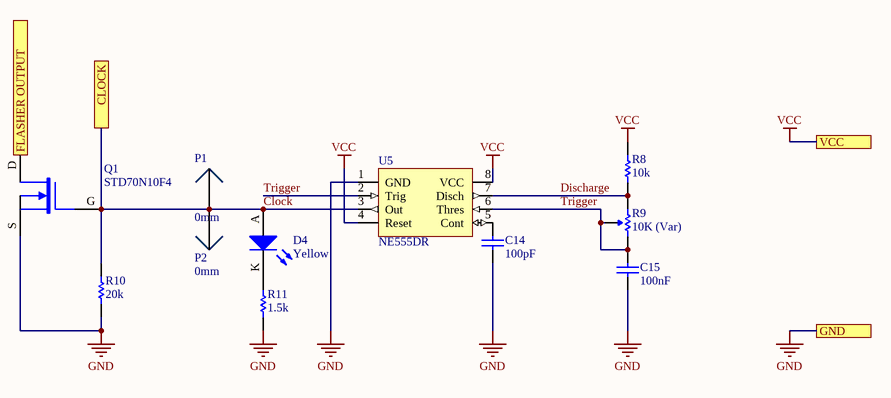
[diagram p4: Flasher.SchDoc]

### Parts
C14  100pF  [0805]
C15  100nF  [0805]
D4  Yellow  [0805 LED]
P1  0mm  [SMD Test Point]
P2  0mm  [TH Test Point]
Q1  STD70N10F4  [STM TO-252 MOSFET]
R8  10k  [0805]
R9  10K (Var)  [B 3296]
R10  20k  [0805]
R11  1.5k  [0805]
U5  NE555DR  [TI 8-SOIC]

### Ports
CLOCK, FLASHER OUTPUT, GND, VCC

### Nets
GND: C14.1 C15.1 Q1.S R10.1 R11.1 U5.1(GND) ; port GND  [project net 0V]
VCC: R8.2 U5.4(Reset) U5.8(VCC) ; port VCC
Clock: D4.A P1.1 P2.1 Q1.G R10.2 U5.3(Out) ; port CLOCK
Discharge: R8.1 R9.3(CW) U5.7(Disch)
Trigger: C15.2 R9.1(CCW) R9.2(Wiper) U5.2(Trig) U5.6(Thres)
NetC14_2: C14.2 U5.5(Cont)
NetD4_K: D4.K R11.2
NetQ1_D: Q1.D ; port FLASHER OUTPUT

### Library data of the parts
C14 = GCM21B5C1H101JA37L: as C29#1 on sheet Sensors; Part Number: GCM21B5C1H101JA37L; Value: 100pF
C15 = GCM21BR71E104KA37L: as C21 on sheet Sensors; Part Number: GCM21BR71E104KA37L; Value: 100nF
D4 = SML-211YTT86: Yellow LED Indication - Discrete 1.75V 0805 (2012 Metric); Manufacturer: ROHM Semiconductor; Part Number: SML-211YTT86; Colour: Yellow; Digikey Part Number: 511-1293-1-ND; Digikey Link: https://www.digikey.com/product-detail/en/rohm-semiconductor/SML-211YTT86/511-1293-1-ND/637106
P1 = SMD Test Point: as 1 on sheet Power Supply; Part Number: SMD Test Point; Pitch: 0mm; Angle: 0
P2 = TH Test Point: as 5 on sheet Sensors; Part Number: TH Test Point; Pitch: 0mm; Row Spacing: 0mm
Q1 = STD70N10F4: N-Channel 100V 60A (Tc) 125W (Tc) Surface Mount DPAK; Manufacturer: STMicroelectronics; Published: 24-Mar-1999; LatestRevisionDate: 29-May-2009; LatestRevisionNote: IPC-7351 Footprint Added.; PackageVersion: Sep-2000; PackageReference: SOT-343; Publisher: Altium Limited; PackageDescription: 4-Pin SOT-343 Package 1.3 mm Pitch, 2.1 mm Lead Span; Part Number: STD70N10F4; Digikey Part Number: 497-8806-2-ND; Digikey Link: https://www.digikey.com/product-detail/en/stmicroelectronics/STD70N10F4/497-8806-2-ND/2035599
R8 = RC0805FR0710KL: as R16 on sheet Safety Loops; Part Number: RC0805FR0710KL; Value: 10k; Material: FR-07
R9 = 3296W-1-103LF: as R29 on sheet Sensors; Part Number: 3296W-1-103LF; Value: 10K (Var); Digikey Part Number: 3296W-103LF-ND
R10 = RC0805FR0720KL: as R52 on sheet Sensors; Part Number: RC0805FR0720KL; Value: 20k; Material: FR-07
R11 = RC0805FR071K5L: as R20 on sheet Safety Loops; Part Number: RC0805FR071K5L; Value: 1.5k; Material: FR-07
U5 = NE555DR: IC OSC SGL TIMER 100KHZ 8-SOIC; Manufacturer: Texas Instruments; Part Number: NE555DR; Digikey Part Number: 296-6501-1-ND; Digikey Link: https://www.digikey.com.au/product-detail/en/texas-instruments/NE555DR/296-6501-1-ND/372490

## Sheet Microcontroller.SchDoc
size A3
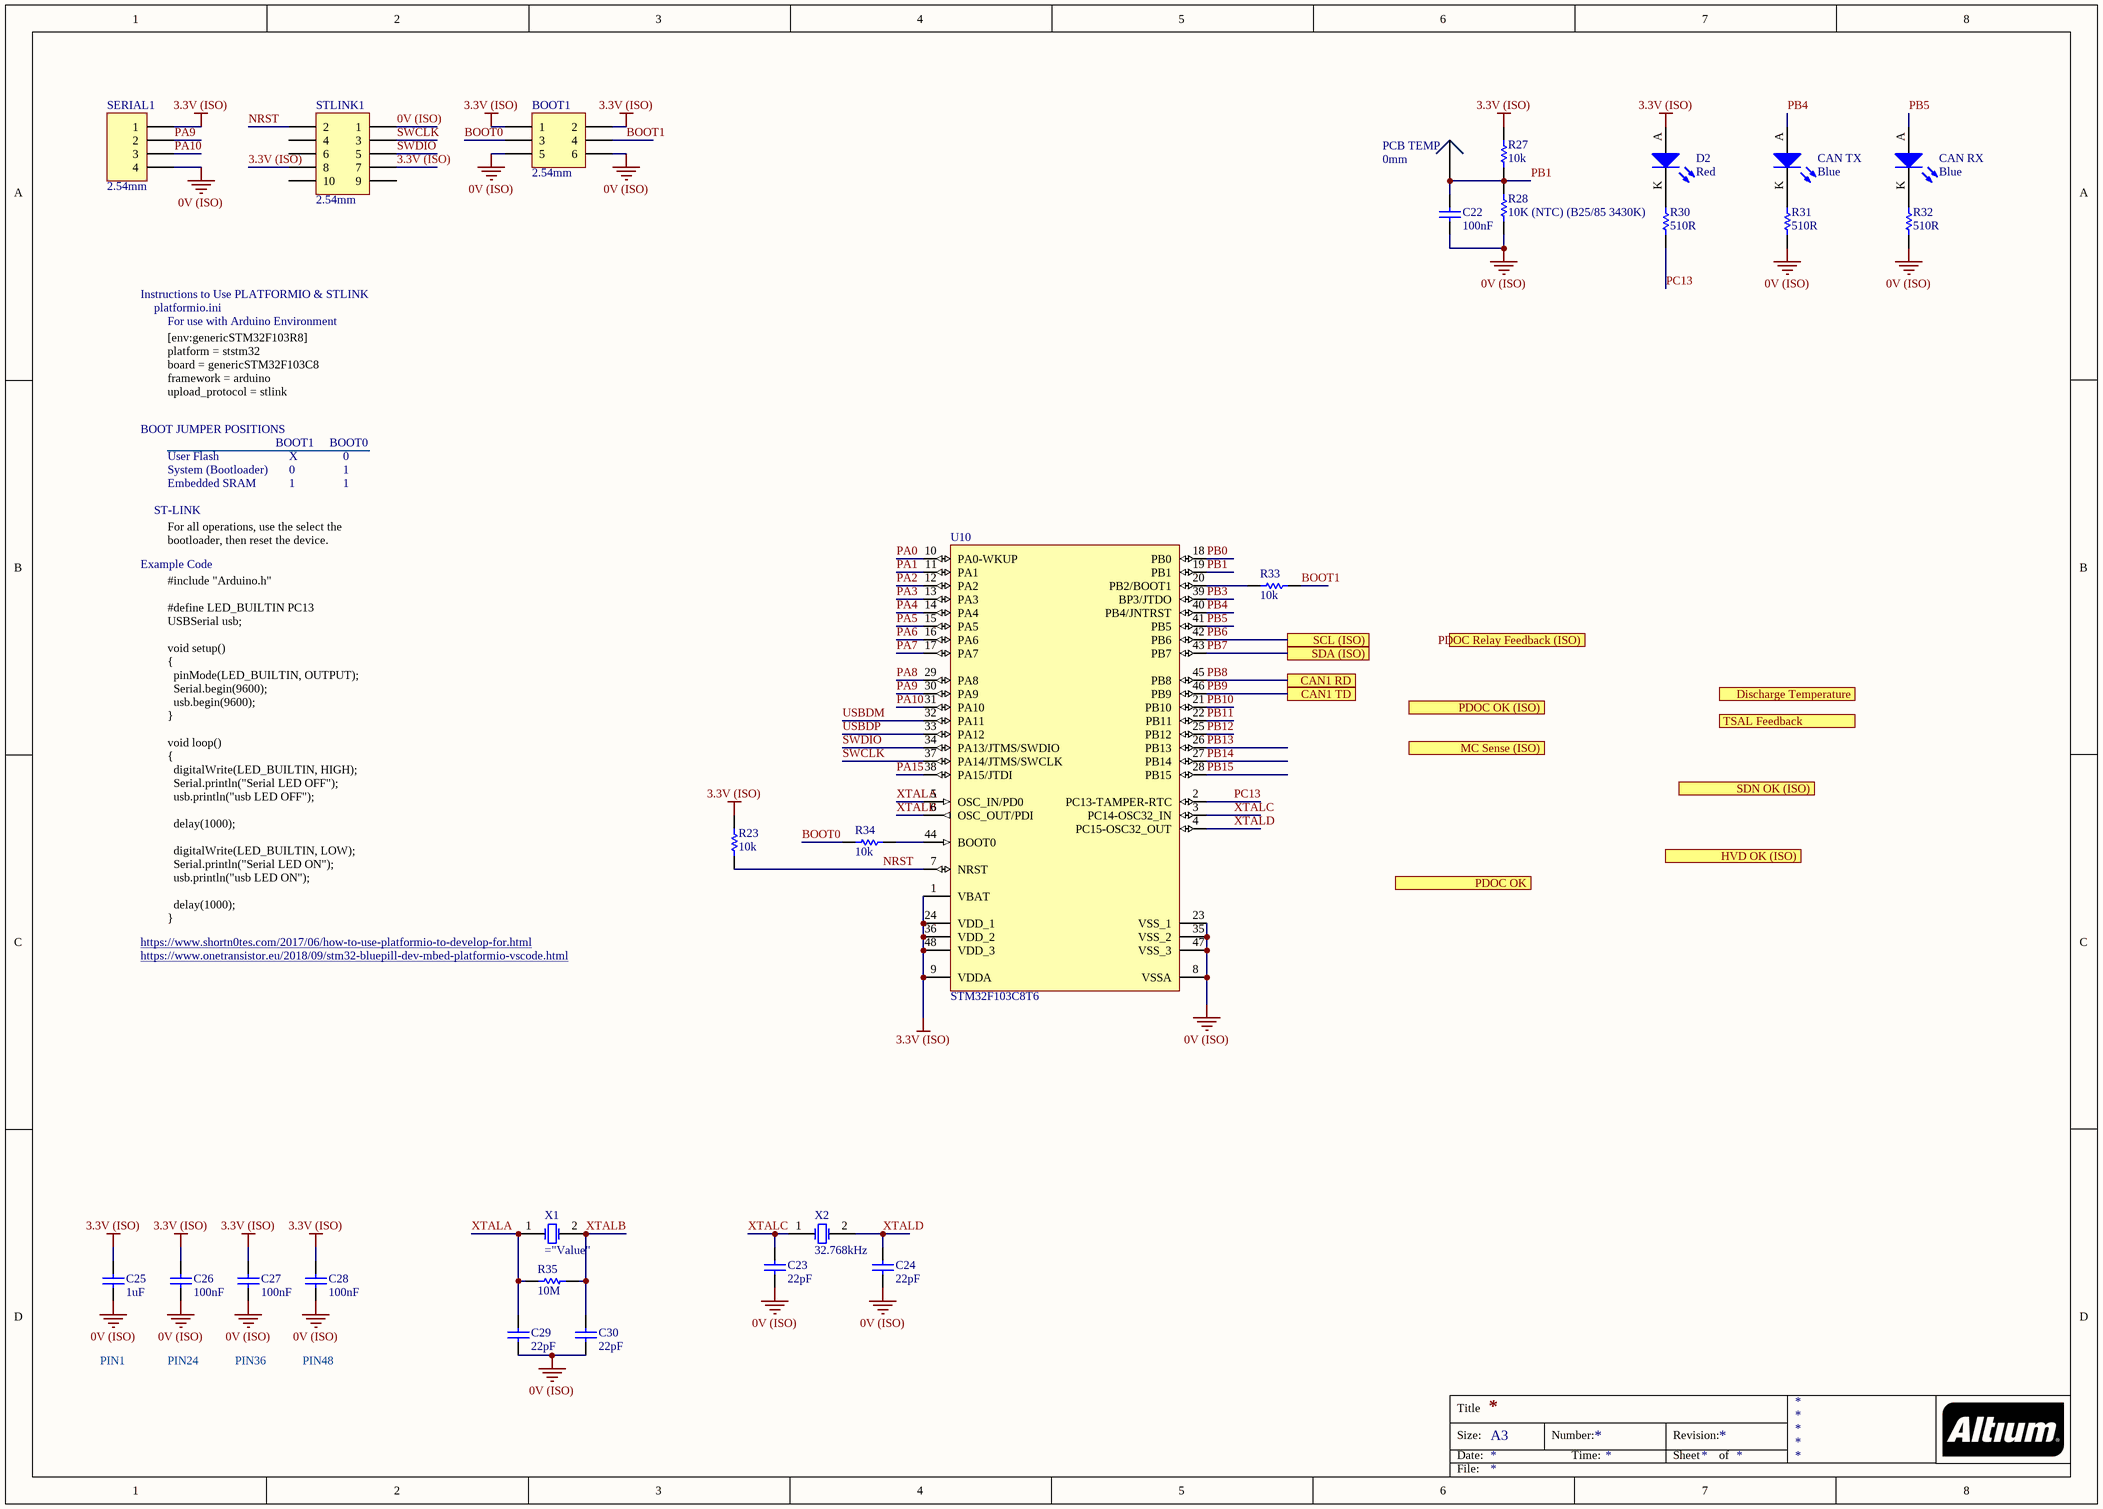
[diagram p5: Microcontroller.SchDoc]

### Parts
(Parts that share a designator on the sheet are numbered #1, #2 ... from top to bottom, then left to right.)
BOOT1  2.54mm  [TH 2.54mm Header 2x3]
C22  100nF  [0805]
C23  22pF  [0805]
C24  22pF  [0805]
C25#2  1uF  [0805]
C26#2  100nF  [0805]
C27#2  100nF  [0805]
C28#2  100nF  [0805]
C29#2  22pF  [0805]
C30#2  22pF  [0805]
CAN_RX  Blue  [0805 LED]
CAN_TX  Blue  [0805 LED]
D2  Red  [0805 LED]
PCB_TEMP  0mm  [SMD Test Point]
R23  10k  [0805]
R27  10k  [0805]
R28  10K (NTC) (B25/85 3430K)  [0805]
R30  510R  [0805]
R31  510R  [0805]
R32  510R  [0805]
R33  10k  [0805]
R34  10k  [0805]
R35  10M  [0805]
SERIAL1  2.54mm  [TH 2.54mm Header 1x4]
STLINK1  2.54mm  [TH 2.54mm Header 2x5]
U10  STM32F103C8T6  [STM 48-LQFP]
X1  (no value)  [Abracon HC-49/US]
X2  32.768kHz  [EPSON 2-SMD]

### Ports
CAN1 RD, CAN1 TD, Discharge Temperature, HVD OK (ISO), MC Sense (ISO), PDOC OK, PDOC OK (ISO), PDOC Relay Feedback (ISO) (out), SCL (ISO), SDA (ISO), SDN OK (ISO), TSAL Feedback

### Nets
0V (ISO): BOOT1.5 BOOT1.6 C22.1 C23.1 C24.1 C25#2.1 C26#2.1 C27#2.1 C28#2.1 C29#2.1 C30#2.1 R28.1 R31.1 R32.1 SERIAL1.4 STLINK1.1 U10.8(VSSA) U10.23(VSS_1) U10.35(VSS_2) U10.47(VSS_3)
3.3V (ISO): BOOT1.1 BOOT1.2 C25#2.2 C26#2.2 C27#2.2 C28#2.2 D2.A R23.2 R27.2 SERIAL1.1 STLINK1.7 STLINK1.8 U10.1(VBAT) U10.9(VDDA) U10.24(VDD_1) U10.36(VDD_2) U10.48(VDD_3)
BOOT0: BOOT1.3 R34.1
BOOT1: BOOT1.4 R33.2
NRST: R23.1 STLINK1.2 U10.7(NRST)
PA0: U10.10(PA0-WKUP)
PA1: U10.11(PA1)
PA2: U10.12(PA2)
PA3: U10.13(PA3)
PA4: U10.14(PA4)
PA5: U10.15(PA5)
PA6: U10.16(PA6)
PA7: U10.17(PA7)
PA8: U10.29(PA8)
PA9: SERIAL1.2 U10.30(PA9)
PA10: SERIAL1.3 U10.31(PA10)
PA15: U10.38(PA15/JTDI)
PB0: U10.18(PB0)
PB1: C22.2 PCB_TEMP.1 R27.1 R28.2 U10.19(PB1)
PB3: U10.39(BP3/JTDO)
PB4: CAN_TX.A U10.40(PB4/JNTRST)
PB5: CAN_RX.A U10.41(PB5)
PB6: U10.42(PB6) ; port SCL (ISO)
PB7: U10.43(PB7) ; port SDA (ISO)
PB8: U10.45(PB8) ; port CAN1 RD
PB9: U10.46(PB9) ; port CAN1 TD
PB10: U10.21(PB10)
PB11: U10.22(PB11)
PB12: U10.25(PB12)
PB13: U10.26(PB13)
PB14: U10.27(PB14)
PB15: U10.28(PB15)
PC13: R30.1 U10.2(PC13-TAMPER-RTC)
SWCLK: STLINK1.3 U10.37(PA14/JTMS/SWCLK)
SWDIO: STLINK1.5 U10.34(PA13/JTMS/SWDIO)
USBDM: U10.32(PA11)
USBDP: U10.33(PA12)
XTALA: C29#2.2 R35.1 U10.5(OSC_IN/PD0) X1.1(OSC1)
XTALB: C30#2.2 R35.2 U10.6(OSC_OUT/PDI) X1.2(OSC2)
XTALC: C23.2 U10.3(PC14-OSC32_IN) X2.1(OSC1)
XTALD: C24.2 U10.4(PC15-OSC32_OUT) X2.2(OSC2)
NetCAN_RX_K: CAN_RX.K R32.2
NetCAN_TX_K: CAN_TX.K R31.2
NetD2_K: D2.K R30.2
NetR33_1: R33.1 U10.20(PB2/BOOT1)
NetR34_2: R34.2 U10.44(BOOT0)

Not connected (* = marked no-connect by the designer): STLINK1 4 6 9 10

### Notes on the sheet
- Instructions to Use PLATFORMIO & STLINK
- platformio.ini
- For use with Arduino Environment
- BOOT JUMPER POSITIONS
- [env:genericSTM32F103R8]
  platform = ststm32
  board = genericSTM32F103C8
  framework = arduino
  upload_protocol = stlink
- BOOT1
- BOOT0
- ST-LINK
- User Flash
- System (Bootloader)
- Embedded SRAM
- X
- 1
- 0
- Example Code
- For all operations, use the select the bootloader, then reset the device.
- #include "Arduino.h"
  #define LED_BUILTIN PC13
  USBSerial usb;
  void setup()
  {
  pinMode(LED_BUILTIN, OUTPUT);
  Serial.begin(9600);
  usb.begin(9600);
  }
  void loop()
  {
  digitalWrite(LED_BUILTIN, HIGH);
  Serial.println("Serial LED OFF");
  usb.println("usb LED OFF");
  delay(1000);
  digitalWrite(LED_BUILTIN, LOW);
  Serial.println("Serial LED ON");
  usb.println("usb LED ON");
  delay(1000);
  }
- https://www.shortn0tes.com/2017/06/how-to-use-platformio-to-develop-for.html
- https://www.onetransistor.eu/2018/09/stm32-bluepill-dev-mbed-platformio-vscode.html
- PIN1
- PIN24
- PIN36
- PIN48
- Title
- Size:
- Date:
- A3
- Number:
- Time:
- Revision:
- Sheet
- of
- File:

### Library data of the parts
BOOT1 = TH 2.54mm Header 2x3: Positions: 6; Angle: 0; Flange: No; Contact: NA; Part Number: TH 2.54mm Header 2x3; Pitch: 2.54mm; Row Spacing: 2.54mm
C22 C26#2 C27#2 C28#2 = GCM21BR71E104KA37L: as C21 on sheet Sensors; Part Number: GCM21BR71E104KA37L; Value: 100nF
C23 C24 C29#2 C30#2 = GCM21B5C1H220JA37L: Manufacturer: muRata; Tolerance: 5%; Material: C0G; Rated Voltage: 50V; Part Number: GCM21B5C1H220JA37L; Value: 22pF
C25#2 = GCM21BR71A105KA37L: Manufacturer: muRata; Tolerance: 10%; Material: X7R; Rated Voltage: 10V; Part Number: GCM21BR71A105KA37L; Value: 1uF
CAN_RX CAN_TX = SML-MN2BCTT86C: as D12 on sheet Sensors; Part Number: SML-MN2BCTT86C; Colour: Blue; Digikey Part Number: 846-1207-1-ND; Digikey Link: https://www.digikey.com/product-detail/en/rohm-semiconductor/SMLMN2BCTT86C/846-1207-1-ND/6057239
D2 = SML-210LTT86: as D6 on sheet Power Supply; Part Number: SML-210LTT86; Colour: Red; Digikey Part Number: 511-1286-1-ND; Digikey Link: https://www.digikey.com/product-detail/en/rohm-semiconductor/SML-210LTT86/511-1286-1-ND/637099
PCB_TEMP = SMD Test Point: as 1 on sheet Power Supply; Part Number: SMD Test Point; Pitch: 0mm; Angle: 0
R23 R27 R33 R34 = RC0805FR0710KL: as R16 on sheet Safety Loops; Part Number: RC0805FR0710KL; Value: 10k; Material: FR-07
R28 = NTCS0805E3103FLT: Manufacturer: Vishay Beyschlag; Tolerance: 0.01; Rated Voltage: 210mW; Part Number: NTCS0805E3103FLT; Value: 10K (NTC) (B25/85 3430K); Digikey Part Number: BC2733CT-ND
R30-R32 = RC0805FR07510RL: as R13 on sheet Power Supply; Part Number: RC0805FR07510RL; Value: 510R; Material: FR-07
R35 = RC0805FR0710ML: Manufacturer: YAGEO; Tolerance: 0.01; Rated Voltage: 0.125W; Part Number: RC0805FR0710ML; Value: 10M; Material: FR-07
SERIAL1 = TH 2.54mm Header 1x4: Positions: 4; Angle: 0; Flange: No; Contact: NA; Part Number: TH 2.54mm Header 1x4; Pitch: 2.54mm; Row Spacing: 2.54mm
STLINK1 = TH 2.54mm Header 2x5: Positions: 10; Angle: 0; Flange: No; Contact: NA; Part Number: TH 2.54mm Header 2x5; Pitch: 2.54mm; Row Spacing: 2.54mm
U10 = STM32F103C8T6: ARM® Cortex®-M3 STM32F1 Microcontroller IC 32-Bit 72MHz 64KB (64K x 8) FLASH; Manufacturer: STMicroelectronics; Part Number: STM32F103C8T6; Digikey Part Number: 497-6063-ND; Digikey Link: https://www.digikey.com/product-detail/en/stmicroelectronics/STM32F103C8T6/497-6063-ND/1646338
X1 = ABLS-16.000MHZ-B4-T: Manufacturer: Abracon LLC; Load Capacitance: 18pF; ESR: 40R; Part Number: ABLS-16.000MHZ-B4-T; Digikey Part Number: 535-10226-1-ND; Digikey Link: https://www.digikey.com/product-detail/en/abracon-llc/ABLS-16.000MHZ-B4-T/535-10226-1-ND/2184261
X2 = FC-135 32.7680KA-A5: Manufacturer: EPSON; Load Capacitance: 12.5pF; ESR: 70k; Part Number: FC-135 32.7680KA-A5; Value: 32.768kHz; Digikey Part Number: SER4103TR-ND; Digikey Link: https://www.digikey.com/product-detail/en/epson/FC-135-32.7680KA-A5/SER4103TR-ND/5259895

## Sheet Discharge.SchDoc
size A4
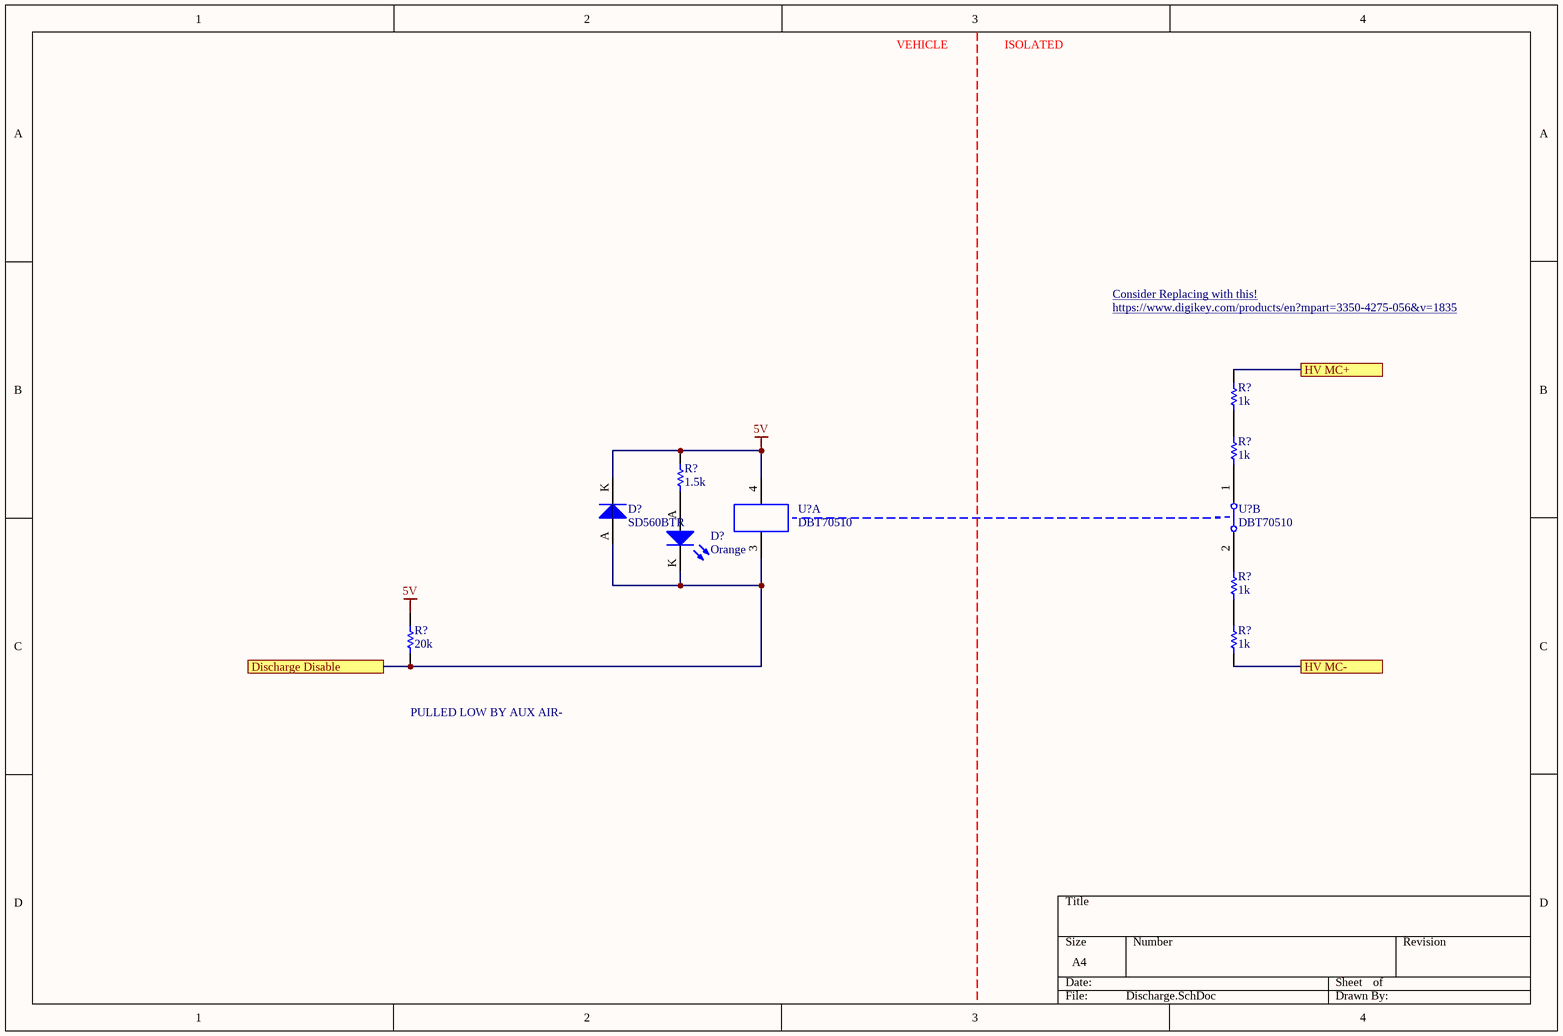
[diagram p6: Discharge.SchDoc]

### Parts
(Parts that share a designator on the sheet are numbered #1, #2 ... from top to bottom, then left to right.)
D?#1  Orange  [0805 LED]
D?#2  SD560BTR  [SMB Diode]
R?#1  1k  [B TO-263]
R?#2  1k  [B TO-263]
R?#3  1.5k  [0805]
R?#4  1k  [B TO-263]
R?#5  20k  [0805]
R?#6  1k  [B TO-263]
U?#1  DBT70510  [C3 SPST]  (part A of 2)
U?#2  DBT70510  [C3 SPST]  (part B of 2)

### Ports
Discharge Disable, HV MC+, HV MC-

### Nets
5V: D?#2.K R?#3.2 R?#5.2 U?#1.4
NetD?#1_A: D?#1.A R?#3.1
NetD?#1_K: D?#1.K D?#2.A R?#5.1 U?#1.3 ; port Discharge Disable
NetR?#1_1: R?#1.1 R?#2.2
NetR?#1_2: R?#1.2 ; port HV MC+
NetR?#4_1: R?#4.1 R?#6.2
NetR?#4_2: R?#4.2 U?#2.2
NetR?#6_1: R?#6.1 ; port HV MC-

Not connected (* = marked no-connect by the designer): R?#2 1; U?#2 1

### Notes on the sheet
- VEHICLE
- ISOLATED
- https://www.digikey.com/products/en?mpart=3350-4275-056&v=1835
- Consider Replacing with this! <https://www.digikey.com/products/en?mpart=3350-4275-056&v=1835>
- PULLED LOW BY AUX AIR-

### Library data of the parts
D?#1 = SML-211DTT86: Orange LED Indication - Discrete 1.75V 0805 (2012 Metric); Manufacturer: ROHM Semiconductor; Part Number: SML-211DTT86; Colour: Orange; Digikey Part Number: 511-1291-1-ND; Digikey Link: https://www.digikey.com/product-detail/en/rohm-semiconductor/SML-211DTT86/511-1291-1-ND/637104
D?#2 = SD560BTR: as D5 on sheet Power Supply; Part Number: SD560BTR; Digikey Part Number: 1655-1530-2-ND; Digikey Link: https://www.digikey.com/product-detail/en/smc-diode-solutions/SD560BTR/1655-1530-2-ND/6022620
R?#1 R?#2 R?#4 R?#6 = PWR263S-35-1001J: Manufacturer: Bournes Inc; Tolerance: 0.05; Rated Voltage: 35W; Part Number: PWR263S-35-1001J; Value: 1k; Digikey Part Number: PWR263S-35-1001J-ND
R?#3 = RC0805FR071K5L: as R20 on sheet Safety Loops; Part Number: RC0805FR071K5L; Value: 1.5k; Material: FR-07
R?#5 = RC0805FR0720KL: as R52 on sheet Sensors; Part Number: RC0805FR0720KL; Value: 20k; Material: FR-07
U?#1 U?#2 = DBT70510: RELAY REED SPST-NC 2A 5V; Manufacturer: Cynergy 3; Part Number: DBT70510; Digikey Part Number: 725-1038-ND; Digikey Link: https://www.digikey.com/product-detail/en/cynergy-3/DBT70510/725-1038-ND/752033

## Nets that join several sheets
0V: Power Supply (7 pins), Sensors (8 pins), Flasher (6 pins)
0V (ISO): Power Supply (4.1 C20.1 R13.1 U7.4), Safety Loops (K1.8 Q2.S R16.1 R19.1), Sensors (26 pins), Microcontroller (20 pins)
3.3V (ISO): Power Supply (2.1 C20.2 D7.A U7.5), Microcontroller (17 pins)
5V: Power Supply (5 pins), Sensors (9 pins), Discharge (D?#2.K R?#3.2 R?#5.2 U?#1.4)
5V (ISO): Safety Loops (5 pins), Sensors (17 pins)
VCC: Sensors (F3.1), Flasher (R8.2 U5.4 U5.8)